# EAGLE schematic switchcontrol (EAGLE 6.5.0)
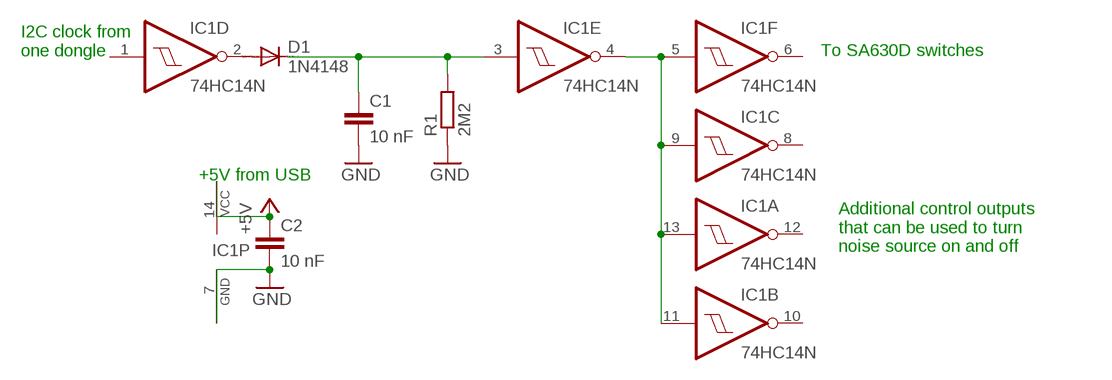
[diagram p0: schematic, sheet 1]

## Parts
C1  10 nF  C-EU025-024X044  [C025-024X044]
C2  10 nF  C-EU025-024X044  [C025-024X044]
D1  1N4148  1N4148DO35-10  [DO35-10]
IC1  74HC14N  7414N  [DIL14]
R1  2M2  R-EU_0204/5  [0204/5]

## Nets
+5V: C2.1 IC1.14(P:VCC)
GND: C1.2 C2.2 IC1.7(P:GND) R1.1
N$1: D1.A IC1.2(D:O)
N$2: C1.1 D1.C IC1.3(E:I) R1.2
N$3: IC1.4(E:O) IC1.5(F:I) IC1.9(C:I) IC1.11(B:I) IC1.13(A:I)
Unconnected: IC1.1(D:I) IC1.6(F:O) IC1.8(C:O) IC1.10(B:O) IC1.12(A:O)

## Notes on the sheet
- I2C clock from
  one dongle
- To SA630D switches
- +5V from USB
- Additional control outputs
  that can be used to turn
  noise source on and off

## Library data of the parts
C1 C2 = rcl:C-EU: CAPACITOR, European symbol
D1 = diode:1N4148: DIODE high speed (Philips)
IC1 = 74xx-us:74*14: Hex schmitt trigger INVERTER
R1 = rcl:R-EU_: RESISTOR, European symbol